# Altium project PCB_Project.PrjPcb
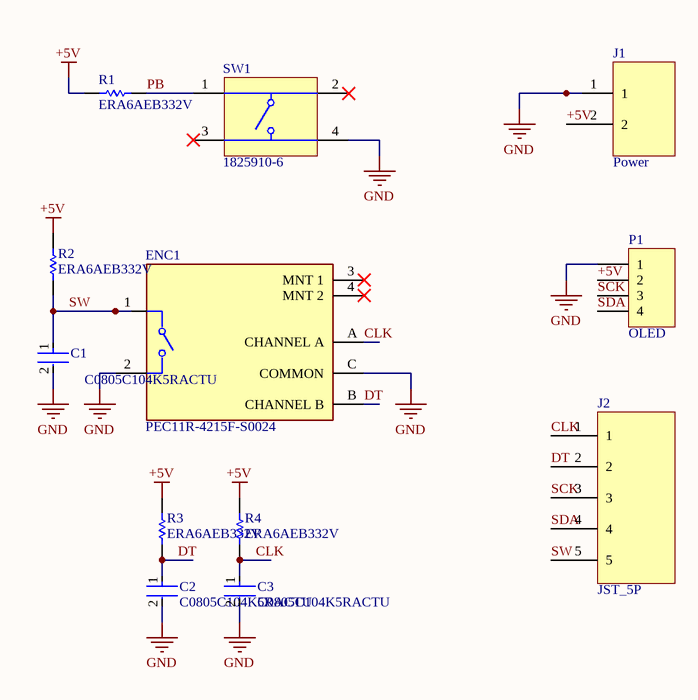
[diagram p0: SheetCopied.SchDoc]
1 sheet, 12 parts. Net scope: global (net labels, ports and power ports of the same name join across sheets).
Board file: PCB1.PcbDoc

## Sheet SheetCopied.SchDoc
size A; SheetNumber: 1; SheetTotal: 1

### Parts
C1  C0805C104K5RACTU  [FP-C0805C-DN-MFG]
C2  C0805C104K5RACTU  [FP-C0805C-DN-MFG]
C3  C0805C104K5RACTU  [FP-C0805C-DN-MFG]
ENC1  PEC11R-4215F-S0024  [FP-PEC11R-4215F-S0024-MFG]
J1  Power  [JST_2P]
J2  JST_5P  [JST_5P]
P1  OLED  [HDR1X4]
R1  ERA6AEB332V  [RESC2013X60X40ML20T25]
R2  ERA6AEB332V  [RESC2013X60X40ML20T25]
R3  ERA6AEB332V  [RESC2013X60X40ML20T25]
R4  ERA6AEB332V  [RESC2013X60X40ML20T25]
SW1  1825910-6  [TECO-1825910-6_V]

### Nets
+5V: J1.2 P1.2 R1.1 R2.2 R3.2 R4.2
GND: C1.2 C2.2 C3.2 ENC1.2 ENC1.C(COMMON) J1.1 P1.1 SW1.4
CLK: C3.1 ENC1.A(CHANNEL_A) J2.1 R4.1
DT: C2.1 ENC1.B(CHANNEL_B) J2.2 R3.1
PB: R1.2 SW1.1
SCK: J2.3 P1.3
SDA: J2.4 P1.4
SW: C1.1 ENC1.1 J2.5 R2.1

Not connected (* = marked no-connect by the designer): ENC1 3(MNT_1)* 4(MNT_2)*; SW1 2* 3*

### Library data of the parts
C1-C3 = CMP-2007-00279-2: CAP CER 0.1UF 50V X7R 0805; Manufacturer: KEMET; Value: 0.10 μF; Tolerance: 0.1; Temperature Coefficient: 30ppm/°C; Material: Ceramic; Description: C0805 0.10 μF X7R 30ppm/°C 10.00% 50 V; Manufacturer Part Number: C0805C104K5RACTU; Device Class L2: Capacitors; Temperature Range Low: -55°C; Voltage Rating: 50 V; Digikey Description: CAP CER 0.1UF 50V X7R 0805; Category: Cap; ComponentLink2Description: Datasheet; Octopart: https://octopart.com/c0805c104k5ractu-kemet-143926; RoHS: TRUE; ComponentLink2URL: https://content.kemet.com/datasheets/KEM_C1003_C0G_SMD.pdf; Temperature Characteristic: X7R; Temperature: -55°C to +125°C; Height: 0.88mm; Temperature Range High: +125°C; Device Class L1: Passive Components; Automotive: No; Lead Free: Yes; Ipc Land Pattern Name: CAPC200125X78; Device Class L3: Ceramic Capacitors; Mouser Description: Cap Ceramic 0.1uF 50V X7R 10% SMD 2.0 x 1.2 mm 125 C Paper T/R; Capacitance: 0.10 μF; Package: C0805C-DN
ENC1 = CMP-1747-00012-2: ROTARY ENCODER MECHANICAL 24PPR; Hole Diameter: 1.8mm; Output Type: Quadrature; Pulses per Revolution: 24; Number of Channels: 2; Built in Switch: Yes; Min Operating Temperature: -30°C; Series: PEC11R; Type: Mechanical; Package Quantity: 150; Length: 21.5mm; Max Operating Temperature: 70°C; Encoder Type: Mechanical; Height: 13.4mm; Detent: Yes; Packaging: Bulk; Orientation: Vertical; Width: 12.5mm; Termination: PC Pins; Mount: Through Hole; REACH SVHC: No SVHC; Radiation Hardening: No; RoHS Compliant: Yes
J1 = JST_2P
P1 = Header 4: Header, 4-Pin; LatestRevisionDate: 17-Jul-2002; LatestRevisionNote: Re-released for DXP Platform.; Publisher: Altium Limited
R1-R4 = CMP-2001-00629-1: Manufacturer: Panasonic; Part Number: ERA6AEB332V
SW1 = CMP-1684-00021-1: Tact Switch, SPST-NO, 0.05 A, -35 to 85 degC, 4-Pin THD, RoHS, Bulk; Manufacturer: TE Connectivity; Maximum Contact Resistance: 100mOhm; Mechanical Life: 100000Cycles; Bushing Type: Unthreaded; Switch Configuration: OFF(ON); Maximum DC Voltage Rating: 24V; Contact Rating @ Voltage: 0.05A@24VDC; Actuator Color: Black; Body Orientation: Straight; Function: MomentaryContact; Illumination: N/R; Actuator Style: RoundButton; Actuator Material: PolybutyleneTerephthalate; Dielectric Strength: 500VAC; Pole Throw Configuration: SPST; Actuator Length: 1.4mm; Product Weight: N/A; Contact Material: CopperAlloy; Housing Material: N/A; Terminal Type: PCPins; Minimum Insulation Resistance: 100MOhm; Package Description: 4-Pin Through Hole Device, Body 5.99 x 5.99 mm, Pitch 6.5 mm; Part No: 1825910-6; Package Reference: THD; Base Material: N/A; Manufacturer URL: http://www.te.com; Contact Plating: Silver; RoHS: Yes; Datasheet Version: Rev. C9; Electrical Life: 100000Cycles; Maximum AC Voltage Rating: N/A; Thread Size: N/R; Operating Temperature: -35to85C; Mounting: ThroughHole; Dimension: 5.99x5mm; Datasheet URL: http://www.te.com/commerce/DocumentDelivery/DDEController?Action=showdoc&DocId=Customer+Drawing%7F1825910%7FC9%7Fpdf%7FEnglish%7FENG_CD_1825910_C9.pdf%7F1825910-6; Family: 1825910; Seal Location: N/A; Seal Description: N/A; Packaging: N/A